# Altium project uProbe1_1.PrjPcb
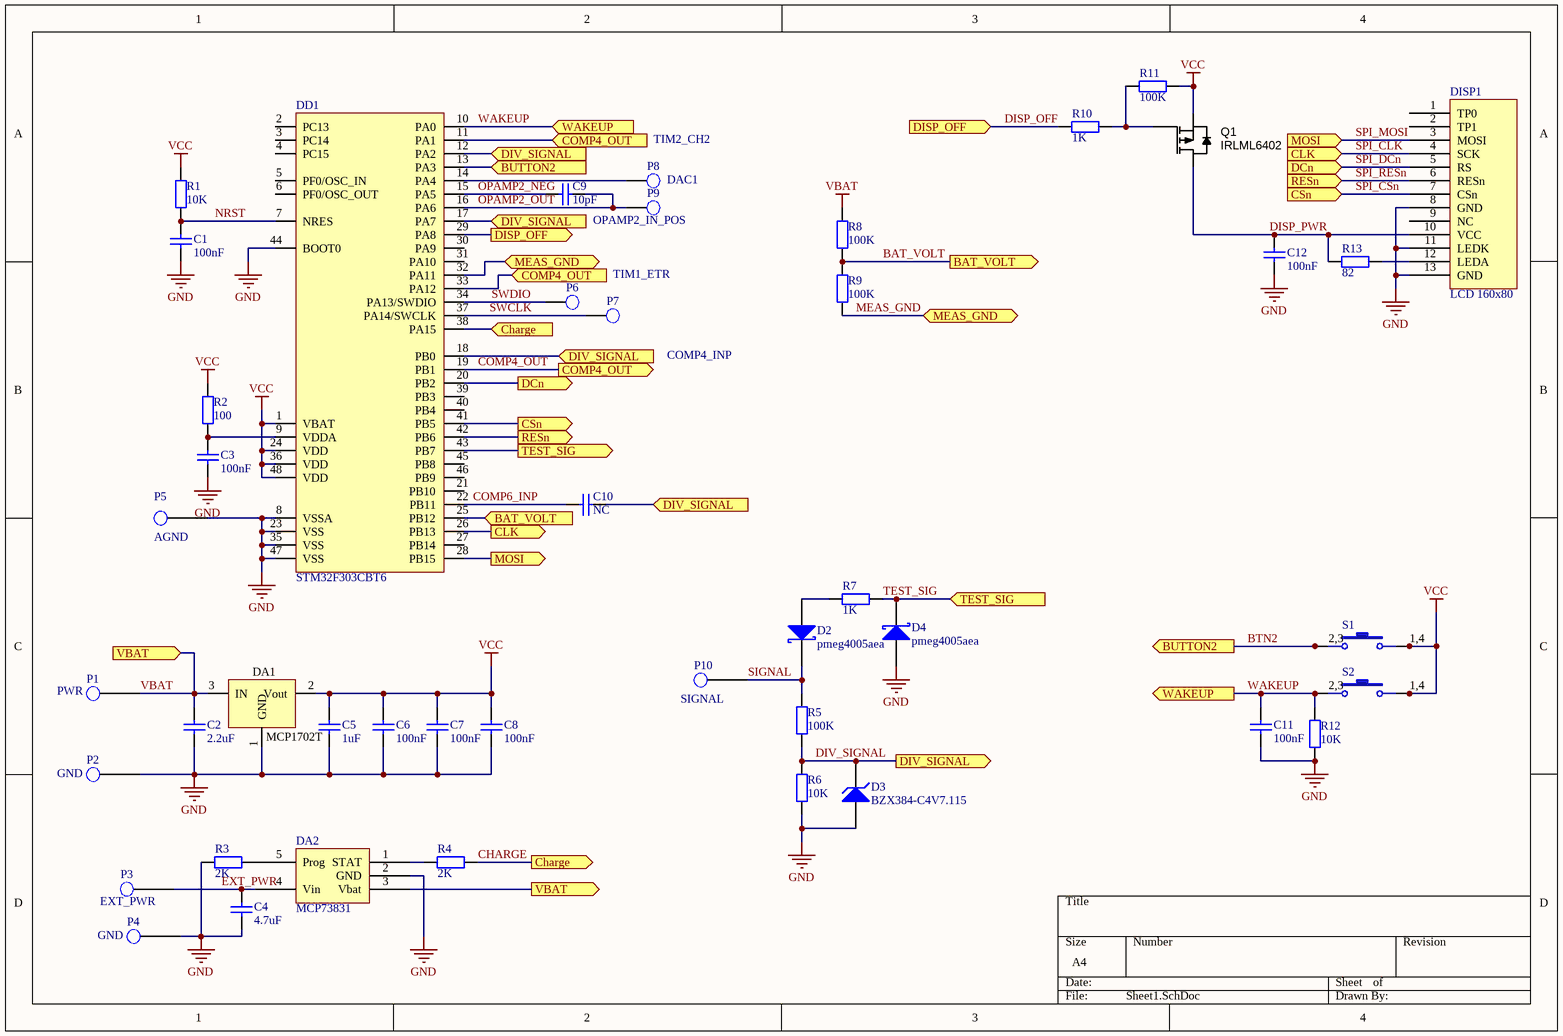
[diagram p0: Sheet1.SchDoc]
1 sheet, 45 parts. Net scope: flat (ports and power ports of the same name join across sheets).
Board file: PCB1.PcbDoc

## Sheet Sheet1.SchDoc
size A4; Date: 2018; PageSetup: Record=PageOptions|CenterHorizontal=True|CenterVertical=True|PrintScale=1.00|XCorrection=1.00|YCorrection=1.00|PrintKind=0|BorderSize=5000000|LeftOffset=0|BottomOffset=0|Orientation=2|PaperLength=1000|PaperWidth=1000|Scale=100|PaperSource=7|PrintQuality=-3|MediaType=1|DitherType=10|PrintScaleMode=1|PaperKind=A4|PaperIndex=9; DocumentName: uProbe

### Parts
C1  100nF  [CAPC1608X90N]
C2  2.2uF  [CAPC2012X135N]
C3  100nF  [CAPC1608X90N]
C4  4.7uF  [CAPC2012X135N]
C5  1uF  [CAPC2012X135N]
C6  100nF  [CAPC1608X90N]
C7  100nF  [CAPC1608X90N]
C8  100nF  [CAPC1608X90N]
C9  10pF  [CAPC1608X90N]
C10  NC  [CAPC1608X90N]
C11  100nF  [CAPC1608X90N]
C12  100nF  [CAPC1608X90N]
D2  pmeg4005aea  [SOD-323F/SC-90_INV]
D3  BZX384-C4V7.115  [SOD-323F/SC-90_INV]
D4  pmeg4005aea  [SOD-323F/SC-90_INV]
DA1  MCP1702T  [SOT23-3]
DA2  MCP73831  [SOT23-5]
DD1  STM32F303CBT6  [LQFP-48_N]
DISP1  LCD 160x80  [LCD_160_80]
P1  PWR  [Ext_pad_2]
P2  GND  [Ext_pad_2]
P3  EXT_PWR  [Ext_pad_2]
P4  GND  [Ext_pad_2]
P5  AGND  [Ext_hole]
P6  Pad  [Ext_pad_2]  (value not drawn)
P7  Pad  [Ext_pad_2]  (value not drawn)
P8  DAC1  [Ext_pad_small]
P9  Pad  [Ext_pad_small]  (value not drawn)
P10  SIGNAL  [Ext_pad]
Q1  IRLML6402  [SOT23-3]
R1  10K  [RESC1608X55N]
R2  100  [RESC1608X55N]
R3  2K  [RESC1608X55N]
R4  2K  [RESC1608X55N]
R5  100K  [RESC1608X55N]
R6  10K  [RESC1608X55N]
R7  1K  [RESC1608X55N]
R8  100K  [RESC1608X55N]
R9  100K  [RESC1608X55N]
R10  1K  [RESC1608X55N]
R11  100K  [RESC1608X55N]
R12  10K  [RESC1608X55N]
R13  82  [RESC1608X55N]
S1  SWT-6  [BUTTON_B3FS]  (value not drawn)
S2  SWT-6  [BUTTON_B3FS]  (value not drawn)

### Ports
BAT_VOLT (in), BAT_VOLT (out), BUTTON2 (in), BUTTON2 (out), Charge (in), Charge (out), CLK (in), CLK (out), COMP4_OUT (in), COMP4_OUT (out), CSn (in), CSn (out), DCn (in), DCn (out), DISP_OFF (in), DISP_OFF (out), DIV_SIGNAL (in), DIV_SIGNAL (out), MEAS_GND, MOSI (in), MOSI (out), RESn (in), RESn (out), TEST_SIG (in), TEST_SIG (out), VBAT (in), VBAT (out), WAKEUP (in), WAKEUP (out)

### Nets
GND: C1.1 C2.2 C3.1 C4.1 C5.1 C6.1 C7.1 C8.1 C11.2 C12.2 D3.1(A) D4.1(A) DA1.1(GND) DA2.2(GND) DD1.8(VSSA) DD1.23(VSS) DD1.35(VSS) DD1.44(BOOT0) DD1.47(VSS) DISP1.8(GND) DISP1.11(LEDK) DISP1.13(GND) P2.1(Pad) P4.1(Pad) P5.1(Pad) R3.2 R6.2 R12.2
VBAT: C2.1 DA1.3(IN) DA2.3(Vbat) P1.1(Pad) R8.1 ; port VBAT
VCC: C5.2 C6.2 C7.2 C8.2 DA1.2(Vout) DD1.1(VBAT) DD1.24(VDD) DD1.36(VDD) DD1.48(VDD) Q1.2(S) R1.1 R2.2 R11.2 S1.1 S1.4 S2.1 S2.4
BAT_VOLT: DD1.25(PB12) R8.2 R9.1 ; port BAT_VOLT
BTN2: DD1.13(PA3) S1.2 S1.3 ; port BUTTON2
CHARGE: DD1.38(PA15) R4.1 ; port Charge
COMP4_OUT: DD1.11(PA1) DD1.19(PB1) DD1.33(PA12) ; port COMP4_OUT
COMP6_INP: C10.2 DD1.22(PB11)
DISP_OFF: DD1.29(PA8) R10.1 ; port DISP_OFF
DISP_PWR: C12.1 DISP1.10(VCC) Q1.3(D) R13.1
DIV_SIGNAL: C10.1 D3.2(K) DD1.12(PA2) DD1.17(PA7) DD1.18(PB0) R5.2 R6.1 ; port DIV_SIGNAL
EXT_PWR: C4.2 DA2.4(Vin) P3.1(Pad)
MEAS_GND: DD1.32(PA11) R9.2 ; port MEAS_GND
NRST: C1.2 DD1.7(NRES) R1.2
OPAMP2_NEG: C9.2 DD1.15(PA5)
OPAMP2_OUT: C9.1 DD1.16(PA6) P9.1(Pad)
SIGNAL: D2.2(K) P10.1(Pad) R5.1
SPI_CLK: DD1.26(PB13) DISP1.4(SCK) ; port CLK
SPI_CSn: DD1.41(PB5) DISP1.7(CSn) ; port CSn
SPI_DCn: DD1.20(PB2) DISP1.5(RS) ; port DCn
SPI_MOSI: DD1.28(PB15) DISP1.3(MOSI) ; port MOSI
SPI_RESn: DD1.42(PB6) DISP1.6(RESn) ; port RESn
SWCLK: DD1.37(PA14/SWCLK) P7.1(Pad)
SWDIO: DD1.34(PA13/SWDIO) P6.1(Pad)
TEST_SIG: D4.2(K) DD1.43(PB7) R7.2 ; port TEST_SIG
WAKEUP: C11.1 DD1.10(PA0) R12.1 S2.2 S2.3 ; port WAKEUP
NetC3_2: C3.2 DD1.9(VDDA) R2.1
NetD2_1: D2.1(A) R7.1
NetDA2_1: DA2.1(STAT) R4.2
NetDA2_5: DA2.5(Prog) R3.1
NetDD1_14: DD1.14(PA4) P8.1(Pad)
NetDISP1_12: DISP1.12(LEDA) R13.2
NetQ1_1: Q1.1(G) R10.2 R11.1

Not connected (* = marked no-connect by the designer): DD1 2(PC13) 3(PC14) 4(PC15) 5(PF0/OSC_IN) 6(PF0/OSC_OUT) 21(PB10) 27(PB14) 30(PA9) 31(PA10) 39(PB3) 40(PB4) 45(PB8) 46(PB9); DISP1 1(TP0) 2(TP1) 9(NC)

### Notes on the sheet
- (near P8) TIM2_CH2
- (near P9) OPAMP2_IN_POS
- TIM1_ETR
- COMP4_INP
- (in symbol SWT-6) 2,3; 1,4

### Library data of the parts
C1-C12 = CC0805: Chip capacitor; Voltage: 25V; Series: X7R
  C1 C3 C6-C8 C11 C12: Value: 100nF
  C2: Value: 2.2uF
  C4: Value: 4.7uF
  C5: Value: 1uF
  C9: Value: 10pF
  C10: Value: NC
D2 D4 = D Schottky: Schottky Diode; Published: 8-Jun-2000; LatestRevisionDate: 17-Jul-2002; LatestRevisionNote: Re-released for DXP Platform.; PackageReference: SMB; Publisher: Altium Limited; PackageDescription: DO-214-AA/SMB; 2 C-Bend Leads; Body 5.3 x 3.6 mm, inc. leads (LxW); Code_JEDEC: DO-214-AA
D3 = D Zener: Zener Diode; Published: 8-Jun-2000; LatestRevisionDate: 17-Jul-2002; LatestRevisionNote: Re-released for DXP Platform.; PackageReference: DIODE-0.7; Publisher: Altium Limited; PackageDescription: Diode, Thru-Hole; 2 Leads; 0.7 in Pin Spacing
DA1 = MCP1702T: Linear voltage regulator
DA2 = MCP73831: Li-Ion Charger
DD1 = STM32F3_LQFP48: Microcontroller
DISP1 = LCD_160x80
P1-P4 P6-P10 = Ext Pad: Pad for wire
P5 = Hole Pad
Q1 = MOSFET_RZR025P01TL: MOSFET SMD P-CH; Manufacturer 1: Rohm Semiconductor; Rds On (Max) @ Id, Vgs: 61 mOhm @ 2.5A, 4.5V; Ratings: 12V; 2.5A; 1W; SCDType: spec; Value: IRLML6402; Package / Case: SOT23-3; TSMT3; Supplier 1: Digi-Key; Supplier Part Number 1: RZR025P01TLCT-ND; Manufacturer Part Number 1: RZR025P01TL
R1-R13 = RC0805: Chip resistor; Tolerance: 5%
  R1 R6 R12: Value: 10K
  R2: Value: 100
  R3 R4: Value: 2K
  R5 R8 R9 R11: Value: 100K
  R7 R10: Value: 1K
  R13: Value: 82
S1 S2 = SWT-6: Switch